# EAGLE schematic pga460_direct (EAGLE 9.4.2)
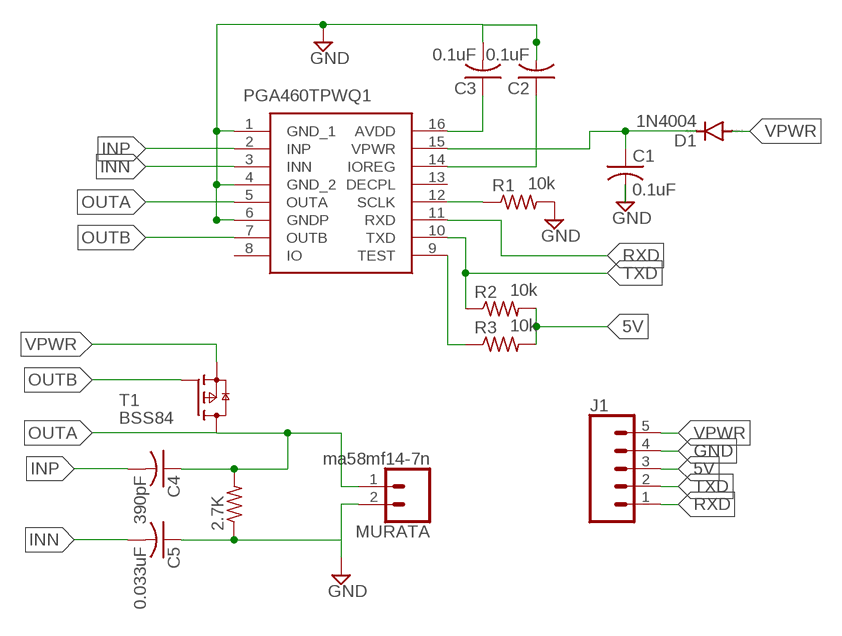
[diagram p0: schematic, sheet 1]

## Parts
2.7K  R-US_M0805  [M0805]
C1  0.1uF  C-USC0805  [C0805]
C2  0.1uF  C-USC0805  [C0805]
C3  0.1uF  C-USC0805  [C0805]
C4  390pF  C-USC0805  [C0805]
C5  0.033uF  C-USC0805  [C0805]
D1  1N4004  [DO41-10]
IC1  PGA460TPWQ1  [SOP65P640X120-16N]
J1  CONN_05  [1X05]
MURATA  ma58mf14-7n  CONN_02LOCK  [1X02_LOCK]
R1  10k  R-US_R0805  [R0805]
R2  10k  R-US_R0805  [R0805]
R3  10k  R-US_R0805  [R0805]
T1  BSS84  [SOT23]

## Nets
5V: J1.3 R2.2 R3.2
GND: 2.7K.1 C1.2 C2.2 C3.2 C5.1 IC1.1(GND_1) IC1.4(GND_2) IC1.6(GNDP) J1.4 MURATA.2 R1.2
INN: C5.2 IC1.3(INN)
INP: C4.2 IC1.2(INP)
N$1: IC1.12(SCLK) R1.1
N$2: C1.1 D1.C IC1.15(VPWR)
N$3: C3.1 IC1.16(AVDD)
N$4: IC1.9(TEST) R3.1
N$7: C2.1 IC1.14(IOREG)
OUTA: 2.7K.2 C4.1 IC1.5(OUTA) MURATA.1 T1.3(D)
OUTB: IC1.7(OUTB) T1.1(G)
RXD: IC1.11(RXD) J1.1
TXD: IC1.10(TXD) J1.2 R2.1
VPWR: D1.A J1.5 T1.2(S)
Unconnected: IC1.8(IO) IC1.13(DECPL)

## Library data of the parts
2.7K R1-R3 = rcl:R-US_: RESISTOR, American symbol; SPICEPREFIX: R
C1-C5 = adafruit:C-US: CAPACITOR, American symbol
D1 = diode:1N4004: DIODE general purpose rectifier, 1 A
IC1 = PGA460TPWQ1:PGA460TPWQ1: Analog Front End - AFE Automotive Ultrasonic Signal Processor & Transducer Driver 16-TSSOP -40 to 105 Source: Datasheet <http://www.ti.com/lit/gpn/pga460>; DESCRIPTION: Analog Front End - AFE Automotive Ultrasonic Signal Processor & Transducer Driver 16-TSSOP -40 to 105; HEIGHT: 1.2mm; MANUFACTURER_NAME: Texas Instruments; MANUFACTURER_PART_NUMBER: PGA460TPWQ1; MOUSER_PART_NUMBER: 595-PGA460TPWQ1; MOUSER_PRICE-STOCK: https://www.mouser.com/Search/Refine.aspx?Keyword=595-PGA460TPWQ1
J1 = SparkFun-Connectors:CONN_05: Multi connection point. Often used as Generic Header-pin footprint for 0.1 inch spaced/style header connections On any of the 0.1 inch spaced packages, you can populate with these: Break Away Headers - Straight <https://www.sparkfun.com/products/116> (PRT-00116) Break Away Male Headers - Right Angle <https://www.sparkfun.com/products/553> (PRT-00553) Female Headers <https://www.sparkfun.com/products/115> (PRT-00115) Break Away Headers - Machine Pin <https://www.sparkfun.com/products/117> (PRT-00117) Break Away Female Headers - Swiss Machine Pin <https://www.sparkfun.com/products/743> (PRT-00743) For SCREWTERMINALS and SPRING TERMINALS visit here: Screw Terimnals on SparkFun.com <https://www.sparkfun.com/search/results?term=Screw+Terminals> (5mm/3.5mm/2.54mm spacing) This device is also useful as a general connection point to wire up your design to another part of your project. Our various solder wires solder well into these plated through hole pads. Hook-Up Wire - Assortment (Stranded, 22 AWG) <https://www.sparkfun.com/products/11375> (PRT-11375) Hook-Up Wire - Assortment (Solid Core, 22 AWG) <https://www.sparkfun.com/products/11367> (PRT-11367) View the entire wire category on our website here <https://www.sparkfun.com/categories/141> Special notes: Molex polarized connector foot print use with SKU : PRT-08231 with associated crimp pins and housings. 1MM SMD Version SKU: PRT-10208
MURATA = SparkFun-Connectors:CONN_02: Multi connection point. Often used as Generic Header-pin footprint for 0.1 inch spaced/style header connections On any of the 0.1 inch spaced packages, you can populate with these: Break Away Headers - Straight <https://www.sparkfun.com/products/116> (PRT-00116) Break Away Male Headers - Right Angle <https://www.sparkfun.com/products/553> (PRT-00553) Female Headers <https://www.sparkfun.com/products/115> (PRT-00115) Break Away Headers - Machine Pin <https://www.sparkfun.com/products/117> (PRT-00117) Break Away Female Headers - Swiss Machine Pin <https://www.sparkfun.com/products/743> (PRT-00743) For SCREWTERMINALS and SPRING TERMINALS visit here: Screw Terimnals on SparkFun.com <https://www.sparkfun.com/search/results?term=Screw+Terminals> (5mm/3.5mm/2.54mm spacing) This device is also useful as a general connection point to wire up your design to another part of your project. Our various solder wires solder well into these plated through hole pads. Hook-Up Wire - Assortment (Stranded, 22 AWG) <https://www.sparkfun.com/products/11375> (PRT-11375) Hook-Up Wire - Assortment (Solid Core, 22 AWG) <https://www.sparkfun.com/products/11367> (PRT-11367) View the entire wire category on our website here <https://www.sparkfun.com/categories/141> Special notes: Molex polarized connector foot print use with: PRT-08233 with associated crimp pins and housings. 2.54_SCREWTERM for use with PRT-10571. 3.5mm Screw Terminal footprints for PRT-08084 5mm Screw Terminal footprints for use with PRT-08432
T1 = nxp_60_1_1:BSS84: P-channel enhancement mode vertical DMOS transistor P-channel enhancement mode vertical Diffusion Metal-Oxide Semiconductor (DMOS) transistor in a small Surface-Mounted Device (SMD) plastic package. AAL Eindhoven MK